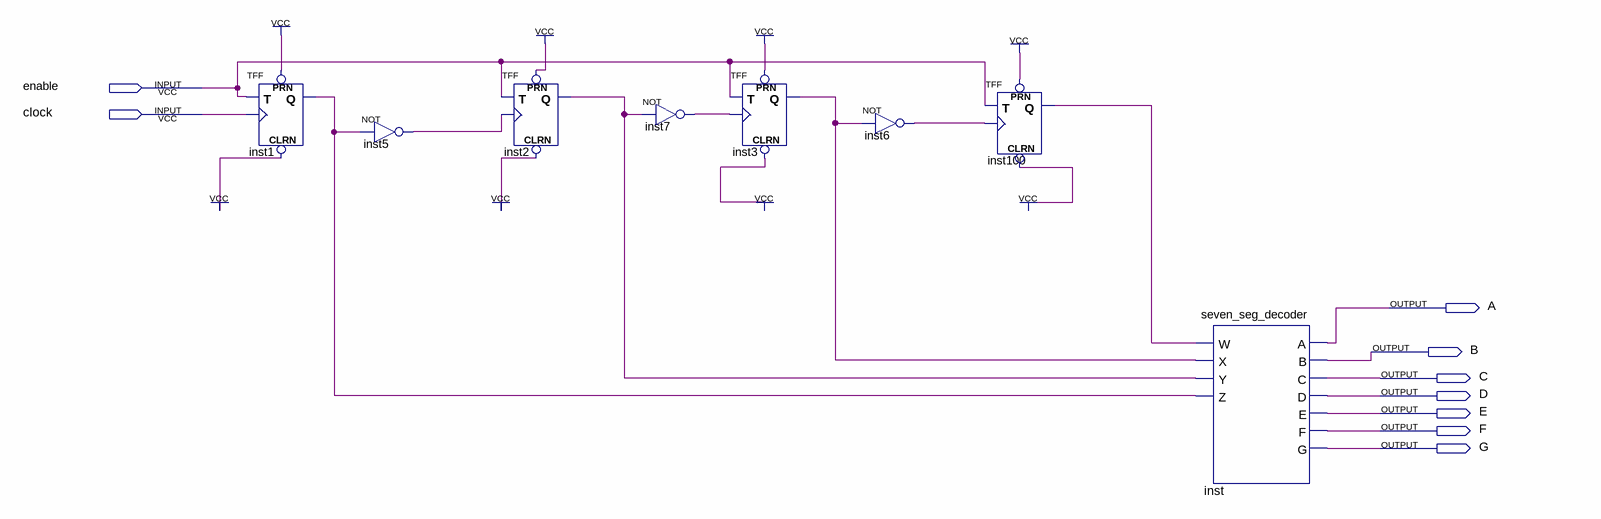
[diagram p0: schematic sheet]
// Quartus schematic labstep33a.bdf as structural Verilog: 8 symbols, 9 pins
module labstep33a (
  input  enable,
  input  clock,
  output A,
  output B,
  output C,
  output D,
  output E,
  output F,
  output G
);

  wire inst1_q, inst2_q, inst3_q, inst5_out, inst6_out, inst7_out, inst100_q;

  TFF inst1 (.PRN(1'b1), .CLRN(1'b1), .T(enable), .CLK(clock), .Q(inst1_q));
  not inst5 (inst5_out, inst1_q);
  TFF inst2 (.PRN(1'b1), .CLRN(1'b1), .T(enable), .CLK(inst5_out), .Q(inst2_q));
  not inst7 (inst7_out, inst2_q);
  TFF inst3 (.PRN(1'b1), .CLRN(1'b1), .T(enable), .CLK(inst7_out), .Q(inst3_q));
  not inst6 (inst6_out, inst3_q);
  TFF inst100 (.PRN(1'b1), .CLRN(1'b1), .T(enable), .CLK(inst6_out), .Q(inst100_q));
  seven_seg_decoder inst (
    .W(inst100_q), .X(inst3_q), .Y(inst2_q), .Z(inst1_q), .A(A), .B(B), .C(C), .D(D), .E(E), .F(F), .G(G));
endmodule
